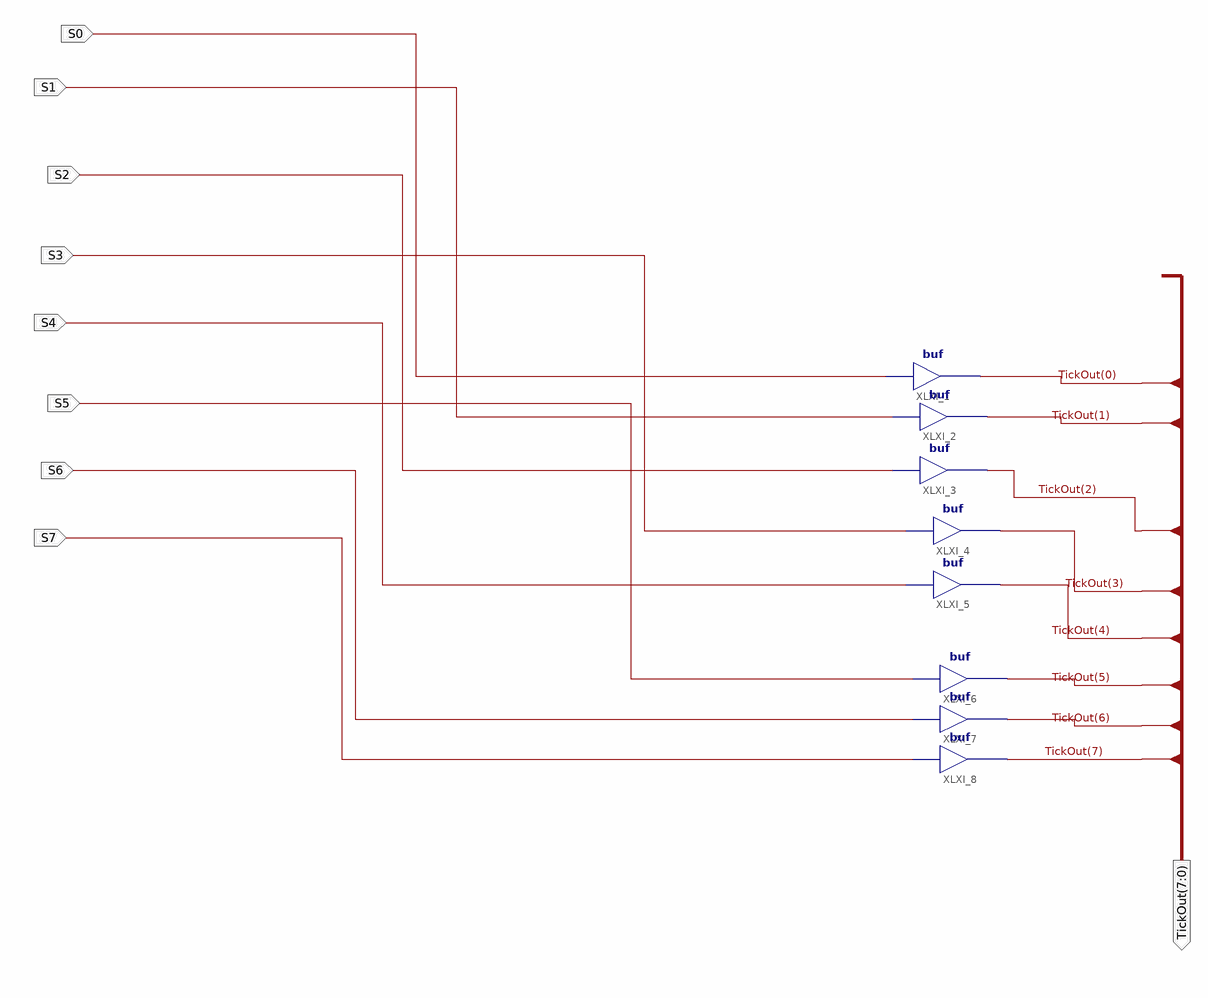
[diagram p0: schematic sheet 1]
// Xilinx ISE schematic TickCombine.sch (spartan3e) as structural Verilog: 8 symbols, 9 ports
module TickCombine (
  input  S0,
  input  S1,
  input  S2,
  input  S3,
  input  S4,
  input  S5,
  input  S6,
  input  S7,
  output [7:0] TickOut
);

  buf XLXI_1 (TickOut[0], S0);
  buf XLXI_2 (TickOut[1], S1);
  buf XLXI_3 (TickOut[2], S2);
  buf XLXI_4 (TickOut[3], S3);
  buf XLXI_5 (TickOut[4], S4);
  buf XLXI_6 (TickOut[5], S5);
  buf XLXI_7 (TickOut[6], S6);
  buf XLXI_8 (TickOut[7], S7);
endmodule
